# EAGLE board HDMI-LVDS (EAGLE 7.6.0)
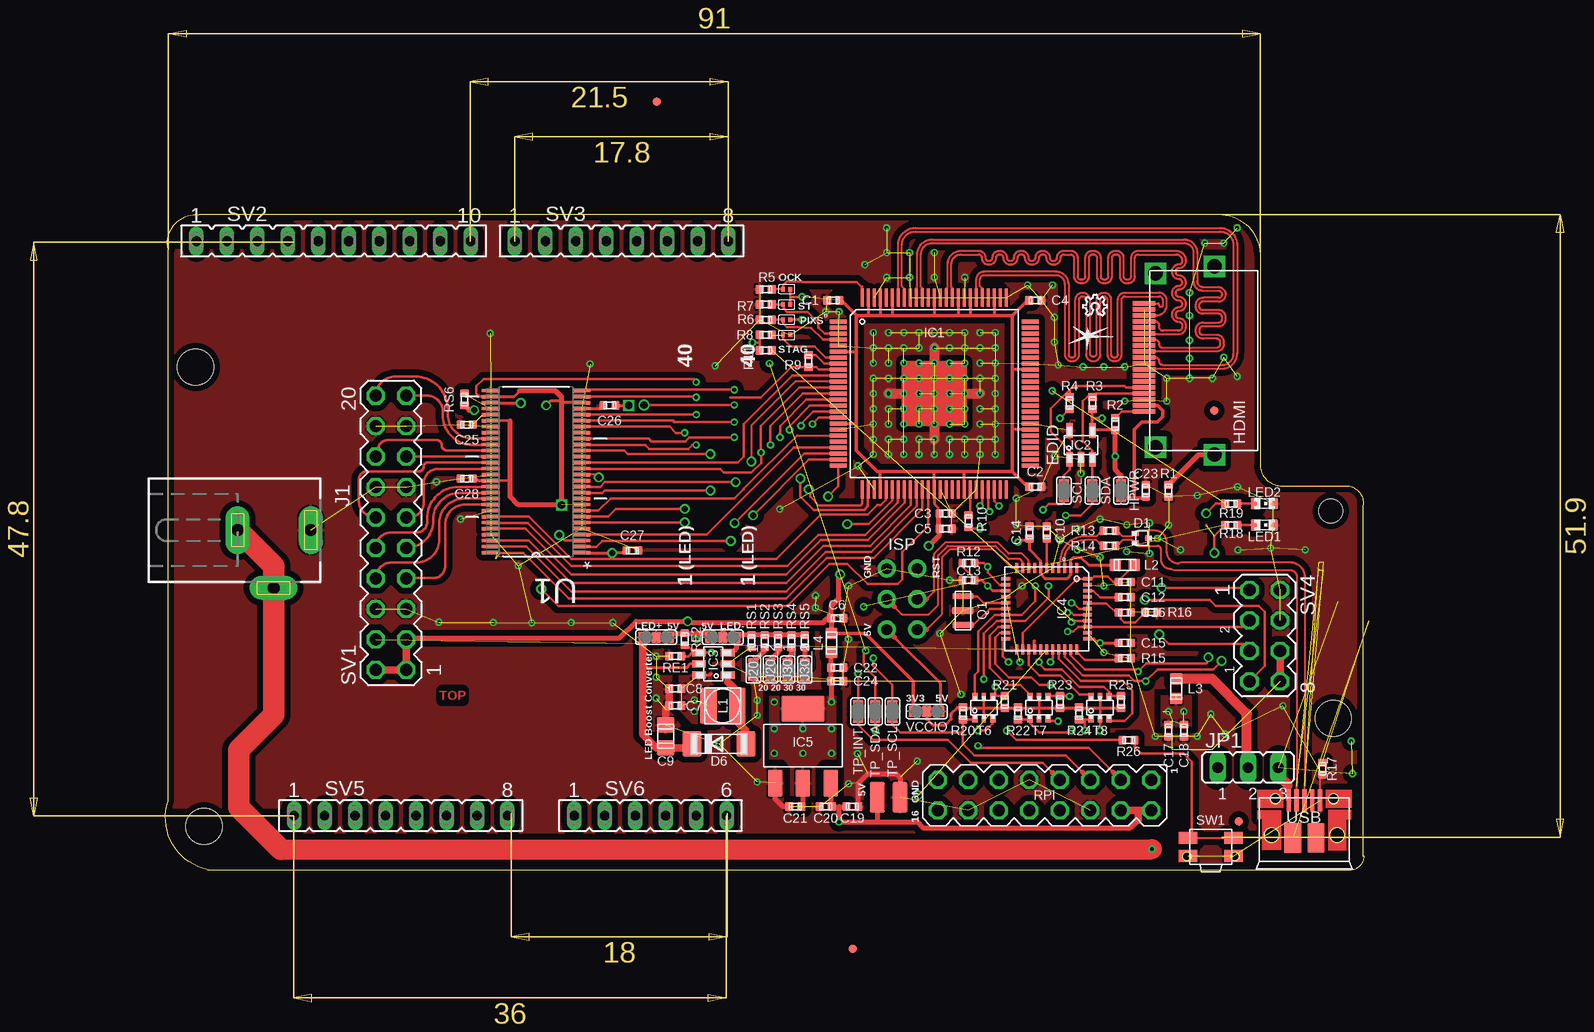
[diagram p3: board, top side]
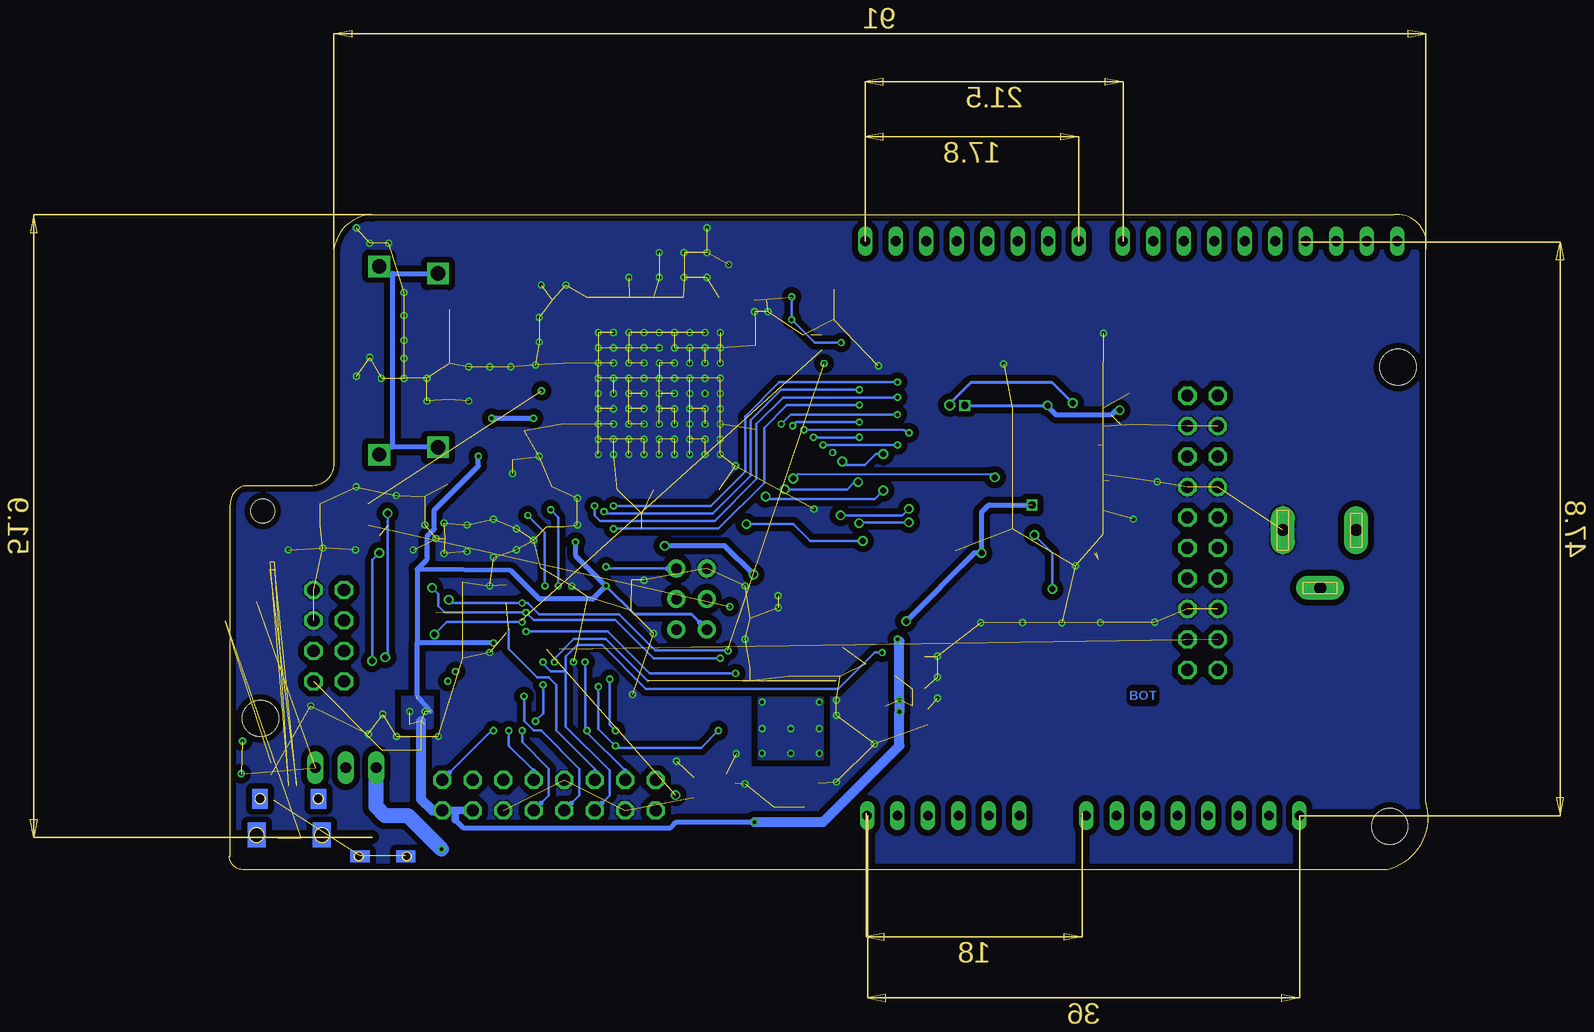
[diagram p4: board, bottom side, seen from below]

Size 99.91 x 54.62 mm. Coordinates in mm from the lower left corner, seen from the top.
Outline: 91.21,53.51 91.21,51.31
Outline: 91.21,51.31 91.21,33.71
Outline: 91.21,33.71 91.21,33.61
Outline: 91.21,33.71 arc90 93.11,32.01 98.41,32.01 arc-94 99.81,30.41 99.81,1.11 99.91,1.11 arc-93 98.61,0.01 3.51,0.01 arc-96 0.21,5.71 0.21,51.71 arc-108 2.81,54.61 88.01,54.61 arc-87 91.21,51.31
Copper layers (1*16): Top 0.035mm / dielectric 1.5mm / Bottom 0.035mm
Design rules "default *": minimum track width 6mil, minimum drill 0.3mm, track to track 6mil, track to pad 6mil, pad to pad 6mil, via to via 6mil, smd to smd 6mil, copper to edge 20mil, drill to drill 6mil, minimum pad ring 8mil, minimum via ring 6mil, stop-mask expansion 4mil, vias tented up to drill 0.5mm, thermal gap 6mil
Net classes: 0 default: clearance 0.5 mm
Holes 3 mm at 3.21,3.61 97.31,12.61 2.51,41.91
Holes 2 mm at 97.11,29.91

## Footprints (pad centres in the part's own frame; a part is rotated, then mirrored left to right if it is on the bottom)
PAD-1.27X2.54_NC = smd 1.27 x 2.54: 1 0,0
C0402 = smd 0.75 x 0.7: 1 0,0.5; 2 0,-0.5
C0805 = smd 1.5 x 1.25: 1 0,0.95; 2 0,-0.95
SOT723 = smd 0.6 x 0.4: 1 -0.55,0.4; 2 -0.55,-0.4; 3 0.55,0
SOD106 = smd 2.1 x 1.6: A 0,-2.25; C 0,2.25
HDMI_10029449 = smd 1.9 x 0.3: 1 -0.95,4.75; 2 -0.95,4.25; 3 -0.95,3.75; 4 -0.95,3.25; 5 -0.95,2.75; 6 -0.95,2.25; 7 -0.95,1.75; 8 -0.95,1.25; 9 -0.95,0.75; 10 -0.95,0.25; 11 -0.95,-0.25; 12 -0.95,-0.75; 13 -0.95,-1.25; 14 -0.95,-1.75; 15 -0.95,-2.25; 16 -0.95,-2.75; 17 -0.95,-3.25; 18 -0.95,-3.75; 19 -0.95,-4.25 | drill 1.2 pad 1.8 square: SHLD1 0,-7.25; SHLD2 4.9,-7.85; SHLD3 4.9,7.85; SHLD4 0,7.25
JUMPER2-0402 = smd 0.9 x 0.8: 1 0,0.55; 2 0,-0.55
TQFP100-PAD = smd 1.5 x 0.28: 1 -8,6; 2 -8,5.5; 3 -8,5; 4 -8,4.5; 5 -8,4; 6 -8,3.5; 7 -8,3; 8 -8,2.5; 9 -8,2; 10 -8,1.5; 11 -8,1; 12 -8,0.5; 13 -8,0; 14 -8,-0.5; 15 -8,-1; 16 -8,-1.5; 17 -8,-2; 18 -8,-2.5; 19 -8,-3; 20 -8,-3.5; 21 -8,-4; 22 -8,-4.5; 23 -8,-5; 24 -8,-5.5; 25 -8,-6; 51 8,-6; 52 8,-5.5; 53 8,-5; 54 8,-4.5; 55 8,-4; 56 8,-3.5; 57 8,-3; 58 8,-2.5; 59 8,-2; 60 8,-1.5; 61 8,-1; 62 8,-0.5; 63 8,0; 64 8,0.5; 65 8,1; 66 8,1.5; 67 8,2; 68 8,2.5; 69 8,3; 70 8,3.5; 71 8,4; 72 8,4.5; 73 8,5; 74 8,5.5; 75 8,6 | smd 0.28 x 1.5: 26 -6,-8; 27 -5.5,-8; 28 -5,-8; 29 -4.5,-8; 30 -4,-8; 31 -3.5,-8; 32 -3,-8; 33 -2.5,-8; 34 -2,-8; 35 -1.5,-8; 36 -1,-8; 37 -0.5,-8; 38 0,-8; 39 0.5,-8; 40 1,-8; 41 1.5,-8; 42 2,-8; 43 2.5,-8; 44 3,-8; 45 3.5,-8; 46 4,-8; 47 4.5,-8; 48 5,-8; 49 5.5,-8; 50 6,-8; 76 6,8; 77 5.5,8; 78 5,8; 79 4.5,8; 80 4,8; 81 3.5,8; 82 3,8; 83 2.5,8; 84 2,8; 85 1.5,8; 86 1,8; 87 0.5,8; 88 0,8; 89 -0.5,8; 90 -1,8; 91 -1.5,8; 92 -2,8; 93 -2.5,8; 94 -3,8; 95 -3.5,8; 96 -4,8; 97 -4.5,8; 98 -5,8; 99 -5.5,8; 100 -6,8
SOT23-5 = smd 1.2 x 0.6: 1 -1.2,0.95; 2 -1.2,0; 3 -1.2,-0.95; 4 1.2,-0.95; 5 1.2,0.95
SOT23-6 = smd 1.2 x 0.6: 1 -1.2,0.95; 2 -1.2,0; 3 -1.2,-0.95; 4 1.2,-0.95; 5 1.2,0; 6 1.2,0.95
QFN44 = smd 0.8 x 0.28: 1 -3.4,2.5; 2 -3.4,2; 3 -3.4,1.5; 4 -3.4,1; 5 -3.4,0.5; 6 -3.4,0; 7 -3.4,-0.5; 8 -3.4,-1; 9 -3.4,-1.5; 10 -3.4,-2; 11 -3.4,-2.5; 23 3.4,-2.5; 24 3.4,-2; 25 3.4,-1.5; 26 3.4,-1; 27 3.4,-0.5; 28 3.4,0; 29 3.4,0.5; 30 3.4,1; 31 3.4,1.5; 32 3.4,2; 33 3.4,2.5 | smd 0.28 x 0.8: 12 -2.5,-3.4; 13 -2,-3.4; 14 -1.5,-3.4; 15 -1,-3.4; 16 -0.5,-3.4; 17 0,-3.4; 18 0.5,-3.4; 19 1,-3.4; 20 1.5,-3.4; 21 2,-3.4; 22 2.5,-3.4; 34 2.5,3.4; 35 2,3.4; 36 1.5,3.4; 37 1,3.4; 38 0.5,3.4; 39 0,3.4; 40 -0.5,3.4; 41 -1,3.4; 42 -1.5,3.4; 43 -2,3.4; 44 -2.5,3.4
SOT223 = smd 2.235 x 1.219: 1 -3.099,2.311; 2 -3.099,0; 3 -3.099,-2.311 | smd 2.2 x 3.6: 4 3.099,0
ISP-2X3 = drill 0.9 pad 1.5: GND 1.27,-2.54; MISO -1.27,2.54; MOSI 1.27,0; RST -1.27,-2.54; SCK -1.27,0; VCC 1.27,2.54
DCJ0202 = drill 1 pad 2 long: 1 0,3.1; 2 4.8,0; 3 0,-3
JP2 = drill 0.914 long: 1 -2.54,0; 2 0,0; 3 2.54,0
L_1212 = smd 3 x 1.4: 1 0,1.2; 2 0,-1.2
C0603 = smd 1 x 0.95: 1 0,0.8; 2 0,-0.8
C0603' = smd 0.9 x 0.8: A 0,-0.75; C 0,0.75
JUMPER3-0402 = smd 0.9 x 0.8: 1 0,1.1; 2 0,0; 3 0,-1.1
JUMPER2-0201_NC = smd 0.4 x 0.4: 1 0,0.3; 2 0,-0.3
CRYSTAL_32X13 = smd 1.8 x 0.5: 1 0,1.2; 2 0,-1.2 | smd 1.8 x 0.6: GND 0,0
MA08-2 = drill 1 octagon: 1 -1.27,8.89; 2 1.27,8.89; 3 -1.27,6.35; 4 1.27,6.35; 5 -1.27,3.81; 6 1.27,3.81; 7 -1.27,1.27; 8 1.27,1.27; 9 -1.27,-1.27; 10 1.27,-1.27; 11 -1.27,-3.81; 12 1.27,-3.81; 13 -1.27,-6.35; 14 1.27,-6.35; 15 -1.27,-8.89; 16 1.27,-8.89
MA10-2 = drill 1.016 octagon: 1 -11.43,-1.27; 2 -11.43,1.27; 3 -8.89,-1.27; 4 -8.89,1.27; 5 -6.35,-1.27; 6 -6.35,1.27; 7 -3.81,-1.27; 8 -3.81,1.27; 9 -1.27,-1.27; 10 -1.27,1.27; 11 1.27,-1.27; 12 1.27,1.27; 13 3.81,-1.27; 14 3.81,1.27; 15 6.35,-1.27; 16 6.35,1.27; 17 8.89,-1.27; 18 8.89,1.27; 19 11.43,-1.27; 20 11.43,1.27
FE10 = drill 0.813 long: 1 -11.43,0; 2 -8.89,0; 3 -6.35,0; 4 -3.81,0; 5 -1.27,0; 6 1.27,0; 7 3.81,0; 8 6.35,0; 9 8.89,0; 10 11.43,0
FE08 = drill 0.813 long: 1 -8.89,0; 2 -6.35,0; 3 -3.81,0; 4 -1.27,0; 5 1.27,0; 6 3.81,0; 7 6.35,0; 8 8.89,0
MA04-2 = drill 1.016 octagon: 1 -3.81,-1.27; 2 -3.81,1.27; 3 -1.27,-1.27; 4 -1.27,1.27; 5 1.27,-1.27; 6 1.27,1.27; 7 3.81,-1.27; 8 3.81,1.27
FE06 = drill 0.813 long: 1 -6.35,0; 2 -3.81,0; 3 -1.27,0; 4 1.27,0; 5 3.81,0; 6 6.35,0
PTS840P = smd 1.65 x 1: 1 -1.9,0.75; 2 1.9,0.75; 3 -1.9,-0.75; 4 1.9,-0.75 | hole 0.7: -2,-0.8; 2,-0.8
SOT363 = smd 0.6 x 0.5: 1 -0.9,0.75; 3 -0.9,-0.75; 4 0.9,-0.75; 6 0.9,0.75 | smd 0.6 x 0.4: 2 -0.9,0; 5 0.9,0
SOP50P810X120-56N = smd 1.473 x 0.279: 1 -3.785,6.756; 2 -3.785,6.248; 3 -3.785,5.74; 4 -3.785,5.258; 5 -3.785,4.75; 6 -3.785,4.242; 7 -3.785,3.759; 8 -3.785,3.251; 9 -3.785,2.743; 10 -3.785,2.261; 11 -3.785,1.753; 12 -3.785,1.245; 13 -3.785,0.762; 14 -3.785,0.254; 15 -3.785,-0.254; 16 -3.785,-0.762; 17 -3.785,-1.245; 18 -3.785,-1.753; 19 -3.785,-2.261; 20 -3.785,-2.743; 21 -3.785,-3.251; 22 -3.785,-3.759; 23 -3.785,-4.242; 24 -3.785,-4.75; 25 -3.785,-5.258; 26 -3.785,-5.74; 27 -3.785,-6.248; 28 -3.785,-6.756; 29 3.785,-6.756; 30 3.785,-6.248; 31 3.785,-5.74; 32 3.785,-5.258; 33 3.785,-4.75; 34 3.785,-4.242; 35 3.785,-3.759; 36 3.785,-3.251; 37 3.785,-2.743; 38 3.785,-2.261; 39 3.785,-1.753; 40 3.785,-1.245; 41 3.785,-0.762; 42 3.785,-0.254; 43 3.785,0.254; 44 3.785,0.762; 45 3.785,1.245; 46 3.785,1.753; 47 3.785,2.261; 48 3.785,2.743; 49 3.785,3.251; 50 3.785,3.759; 51 3.785,4.242; 52 3.785,4.75; 53 3.785,5.258; 54 3.785,5.74; 55 3.785,6.248; 56 3.785,6.756
USB-MICROB-10103594 = smd 1.8 x 0.4: D+ -2.885,0; D- -2.885,-0.65; GND -2.885,1.3; ID -2.885,0.65; VBUS -2.885,-1.3 | smd 2.5 x 1.425: SHLD1 0.25,-0.963; SHLD2 0.25,0.963 | hole 0.8: -3,2.425; -3,-2.425 | hole 1.2: 0.03,2.725; 0.03,-2.725
PASSER_07MM = smd 0.7 x 0.7: X 0,0

## Placement (x,y rotation side)
5V  PAD-1.27X2.54_NC  [PAD-1.27X2.54_NC]  59.31,6.04 0 top
C1  100n  [C0402]  55.66,47.47 90 top
C2  100n  [C0402]  72.49,31.92 270 top
C3  100n  [C0402]  65.02,29.69 270 top
C4  100n  [C0402]  72.49,47.47 270 top
C5  4u7  [C0402]  65.02,28.42 270 top
C6  4u7  [C0402]  55.98,20.96 90 top
C7  2u  [C0402]  42.48,13.66 90 top
C8  100n  [C0402]  42.48,15.09 90 top
C9  1u @ 40V  [C0805]  41.69,11.12 0 top
C10  1u  [C0402]  73.44,28.11 0 top
C11  100n  [C0402]  79.95,23.98 90 top
C12  100n  [C0402]  79.95,22.71 270 top
C13  100n  [C0402]  66.93,24.14 90 top
C14  100n  [C0402]  72.01,28.11 0 top
C15  100n  [C0402]  79.95,18.9 270 top
C16  tbd  [C0402]  79.95,21.44 270 top
C17  100n  [C0402]  83.6,11.6 180 top
C18  4u7  [C0402]  84.87,11.6 180 top
C19  4u7  [C0402]  57.25,5.25 270 top
C20  100n  [C0402]  55.02,5.25 90 top
C21  100n  [C0402]  52.48,5.25 90 top
C22  4u7  [C0402]  55.98,16.84 270 top
C23  100n  [C0402]  81.69,31.6 0 top
C24  4u7  [C0402]  55.98,15.72 270 top
C25  10n  [C0402]  25.11,37.11 90 top
C26  10n  [C0402]  37.01,38.71 90 top
C27  10n  [C0402]  38.91,26.61 270 top
C28  10n  [C0402]  25.11,32.61 90 top
D1  D_ESD5V3U2U-03F  [SOT723]  81.38,27.63 0 top
D6  DIODE-SOD106  [SOD106]  46.13,10.49 90 top
GND  PAD-1.27X2.54_NC  [PAD-1.27X2.54_NC]  61.21,6.04 0 top
HDMI  HDMI-A  [HDMI_10029449]  82.51,42.46 0 top
HPWR  JUMPER2-0402  [JUMPER2-0402]  79.63,31.6 180 top
IC1  TFP401A-PAD  [TQFP100-PAD]  64.07,39.7 0 top
IC2  24LC02B  [SOT23-5]  76.3,35.41 90 top
IC3  IS31BL3506A-TTLS2  [SOT23-6]  45.66,17.15 180 top
IC4  ATMEGA32U4-MU  [QFN44]  73.44,21.76 270 top
IC5  LDO-TS1117CW-3V3  [SOT223]  53.12,10.33 90 top
ISP  ISP  [ISP-2X3]  61.37,22.55 180 top
J1  DCJ0202  [DCJ0202]  9.01,28.31 270 top
J20_1  JUMPER2-0402  [JUMPER2-0402]  48.99,16.68 0 top
J20_2  JUMPER2-0402  [JUMPER2-0402]  50.42,16.68 0 top
J30_1  JUMPER2-0402  [JUMPER2-0402]  51.85,16.68 0 top
J30_2  JUMPER2-0402  [JUMPER2-0402]  53.28,16.68 0 top
JP1  [JP2]  90.21,8.51 0 top
L1  10u@500mA  [L_1212]  46.45,13.66 90 top
L2  [C0603]  79.95,25.41 90 top
L3  BLM18PG221SH1D  [C0603]  84.23,15.09 180 top
L4  BLM18PG221SH1D  [C0603]  55.5,18.9 0 top
LED1  green  [C0603']  91.58,28.73 270 top
LED2  red  [C0603']  91.58,30.52 270 top
LED+  JUMPER3-0402  [JUMPER3-0402]  40.89,19.38 90 top
LED-  JUMPER3-0402  [JUMPER3-0402]  46.45,19.38 270 top
LOGO1  OSHW_LOGOX0070  [OSHW_6X70]  76.48,46.19 0 top
LOGO3  LOGO-S_PLACE_S  [SPARK_TPLACE_S]  76.87,44.48 0 top
OCK  JUMPER2-0201-NC  [JUMPER2-0201_NC]  51.77,48.39 90 top
PIXS  JUMPER2-0201-NC  [JUMPER2-0201_NC]  51.77,45.85 90 top
Q1  16MHz  [CRYSTAL_32X13]  66.45,21.6 0 top
R1  0  [C0402]  83.6,31.6 180 top
R2  1k  [C0402]  79.15,37.16 0 top
R3  10k  [C0402]  77.25,38.9 180 top
R4  10k  [C0402]  75.34,38.9 180 top
R5  10k  [C0402]  50.02,48.39 90 top
R6  10k  [C0402]  50.02,45.85 90 top
R7  10k  [C0402]  50.02,47.12 90 top
R8  10k  [C0402]  50.02,44.58 270 top
R9  1k  [C0402]  53.59,42.39 180 top
R10  22  [C0402]  66.93,29.06 0 top
R11  nc  [C0402]  50.02,43.31 270 top
R12  10k  [C0402]  66.93,25.57 270 top
R13  22  [C0402]  78.68,28.27 270 top
R14  22  [C0402]  78.68,27 270 top
R15  10k  [C0402]  79.95,17.63 90 top
R16  tbd  [C0402]  82.15,21.47 270 top
R17  0  [C0402]  96.42,8.41 180 top
R18  4k7  [C0402]  88.82,28.73 90 top
R19  4k7  [C0402]  88.82,30.52 90 top
R20  4k7  [C0402]  66.45,13.03 180 top
R21  4k7  [C0402]  69.95,13.98 0 top
R22  4k7  [C0402]  71.06,13.03 180 top
R23  4k7  [C0402]  74.55,13.98 0 top
R24  4k7  [C0402]  76.14,13.03 180 top
R25  4k7  [C0402]  79.63,13.98 0 top
R26  1k  [C0402]  80.26,10.8 90 top
RE1  100k  [C0402]  42.48,17.79 90 top
RE2  NM  [C0402]  43.28,19.22 180 top
RPI  MA08-2  [MA08-2]  73.26,6.21 270 top
RS1  15  [C0402]  48.83,19.06 180 top
RS2  15  [C0402]  49.94,19.06 180 top
RS3  15  [C0402]  51.05,19.06 180 top
RS4  10  [C0402]  52.17,19.06 180 top
RS5  10  [C0402]  53.28,19.06 180 top
RS6  10  [C0402]  24.91,39.21 0 top
SCL  JUMPER2-0402  [JUMPER2-0402]  74.87,31.6 0 top
SDA  JUMPER2-0402  [JUMPER2-0402]  77.25,31.6 0 top
ST  JUMPER2-0201-NC  [JUMPER2-0201_NC]  51.77,47.12 90 top
STAG  JUMPER2-0201-NC  [JUMPER2-0201_NC]  51.77,44.58 270 top
SV1  [MA10-2]  18.8,28.09 90 top
SV2  [FE10]  14.01,52.41 0 top
SV3  [FE08]  38.01,52.41 0 top
SV4  [MA04-2]  91.61,19.51 270 top
SV5  [FE08]  19.61,4.51 0 top
SV6  [FE06]  40.41,4.51 0 top
SW1  SW-TACTILE-PTS840P  [PTS840P]  87.11,1.91 0 top
T6  BSS138PS  [SOT363]  68.2,13.5 90 top
T7  BSS138PS  [SOT363]  72.8,13.5 90 top
T8  BSS138PS  [SOT363]  77.88,13.5 90 top
TP_INT  JUMPER2-0402  [JUMPER2-0402]  57.72,13.18 0 top
TP_SCL  JUMPER2-0402  [JUMPER2-0402]  60.58,13.18 0 top
TP_SDA  JUMPER2-0402  [JUMPER2-0402]  59.15,13.18 0 top
U1  SN75LVDS83BDGG  [SOP50P810X120-56N]  30.89,33.19 180 top
USB  USB-MICROB  [USB-MICROB-10103594]  94.91,2.91 270 top
VCCIO  JUMPER3-0402  [JUMPER3-0402]  63.44,13.18 270 top
X1  PASSER-07  [PASSER_07MM]  57.29,-6.59 90 top  (outside the outline)
X2  PASSER-07  [PASSER_07MM]  40.93,64.03 90 top  (outside the outline)
X3  PASSER-07  [PASSER_07MM]  87.41,38.27 90 top
X4  PASSER-07  [PASSER_07MM]  89.45,4.01 90 top

## Tracks (layer width: path | path; a pad name or v marks a point on that pad's centre or on a via)
3VOUT  (via drill 0.3)
  Top 0.406: IC5.2 53.12,5.38 C21.2 | L4.2 55.47,18.08 C22.2 C24.2 55.47,14.27
  other vias: 50.74,13.98 50.74,9.69 55.5,9.69 55.5,13.98 55.5,11.76 50.74,11.76 53.12,9.69 53.12,11.76
  pour Bottom: 50.42,14.45 55.82,14.45 55.82,9.22 50.42,9.22
  pour Top: 50.42,14.45 55.82,14.45 55.82,9.22 54.71,9.22 54.07,8.58 54.07,6.2 52.17,6.2 52.17,8.58 51.53,9.22 50.42,9.22
+3V3  (via drill 0.3, 0.5 pad 0.25, 0.5 pad 0.61, 0.6)  (4 unrouted)
  Top 0.2: U1.1 34.7,26.41 | U1.34 28.69,37.43 28.71,37.41 | U1.44 28.69,32.43 28.71,32.41
  Top 0.203: 58.57,46.26 58.52,46.21 | 60.57,46.21 60.58,46.21 | 69.07,46.28 68.99,46.21 | 67.07,46.22 67.09,46.21 | 66.07,46.27 66.13,46.21 | 70.64,41.7 70.58,41.76 | 70.6,36.7 70.58,36.68 | 66.57,33.15 66.61,33.19 | 59.57,33.13 59.63,33.19 | 57.56,43.2 57.56,43.19 | 57.55,42.7 57.56,42.71 | 57.52,37.2 57.56,37.16 | 59.57,46.26 59.63,46.21 | 64.39,30.17 64.39,29.7 C3.2 | ST.2 52.07,47.76 | 52.07,47.76 OCK.2 | R11.2 49.52,43.95 | 49.52,43.95 R8.2 | PIXS.2 v53.04,45.85 | v53.04,47.76 52.07,47.76 | v48.91,43.95 49.52,43.95 | C5.2 64.4,28.43 64.39,28.44
  Top 0.254: IC1.99 58.57,46.26 | IC1.95 60.57,46.21 | IC1.78 69.07,46.28 | IC1.82 67.07,46.22 | IC1.84 66.07,46.27 | IC1.88 64.07,46.21 | IC1.67 70.64,41.7 | IC1.57 70.6,36.7 | IC1.43 66.57,33.15 | 64.07,33.19 IC1.38 64.07,30.49 64.39,30.17 | IC1.29 59.57,33.13 | IC1.6 57.56,43.2 | IC1.18 57.52,37.2 | IC1.97 59.57,46.26 | 70.58,46.21 70.58,46.22 | 57.56,46.21 57.56,46.22 | 70.58,33.19 70.58,33.17 | U1.26 33.19,38.93 33.01,39.11 32.11,39.11 v31.71,38.71 | 29.51,39.91 29.01,39.41 27.14,39.41 | 25.51,32.41 C28.2 25.91,32.61 26.11,32.41 26.61,32.41 | C27.2 38.21,26.41 v37.21,26.41 34.7,26.41 | C26.2 v38.61,38.71
  Top 0.305: 70.58,46.21 68.99,46.21 67.09,46.21 66.13,46.21 64.07,46.21 60.58,46.21 59.63,46.21 58.52,46.21 57.56,46.21 57.56,43.19 57.56,42.71 57.56,37.16 57.56,34.93 59.31,33.19 59.63,33.19 64.07,33.19 66.61,33.19 70.58,33.19 | 70.58,46.21 70.58,41.76 70.58,36.68 70.58,33.19 | C2.2 71.85,31.92 70.58,33.19 | C4.2 71.85,47.47 70.58,46.21 | C1.2 56.31,47.47 57.56,46.22 | VCCIO.3 62.34,15.68 58.31,19.71 L4.1
  Top 0.406: 64.39,29.7 64.39,28.44 | C6.1 55.47,19.72 L4.1 | C6.1 55.47,21.97 56.11,22.61 56.11,24.51 v56.21,24.61 | v63.61,27.01 64.52,27.92 C5.2 | 55.33,21.11 C6.1 | 37.19,26.43 v37.21,26.41 | 29.51,39.91 32.51,39.91 33.01,39.41 33.01,39.11 v33.01,30.41 29.41,30.41 28.71,31.11 28.71,32.41 28.71,37.41 | C6.1 55.17,20.96 54.81,20.61 43.61,20.61 v43.51,20.71 39.21,20.71 37.81,19.31 20.18,19.31 SV1.3 | v25.71,38.31 25.31,38.31 RS6.2
  Top 0.61: SV1.2 SV1.1 SV1.3
  Bottom 0.203: v53.04,47.76 v53.04,45.85 51.14,43.95 v48.91,43.95
  Bottom 0.254: v38.61,38.71 v31.71,38.71
  Bottom 0.406: v56.21,24.61 58.61,27.01 v63.61,27.01 | v43.51,20.71 37.81,26.41 v37.21,26.41 37.21,29.81 36.61,30.41 v33.01,30.41 | v31.71,38.71 31.71,38.61 31.01,37.91 26.41,37.91 26.01,38.31 v25.71,38.31
+5V  (via drill 0.3)  (13 unrouted)
  Top 0.203: LED-.3 45.35,19.52 45.34,19.54 | 64.55,13.2 VCCIO.1 | R4.1 75.32,38.4 v74.55,37.63 | 77.25,38.25 R3.1 | C13.2 67.43,24.27 66.45,25.25 66.45,25.54 R12.2
  Top 0.254: 45.5,16.36 45.34,16.2 IC3.6 | IC4.34 77.37,19.26 77.72,18.9 v77.88,18.9 C15.2 | L2.1 76.93,25.41 76.29,26.04 75.66,26.04 75.44,25.82 IC4.2 75.44,24.55 75.18,24.3 73.28,24.3 72.94,24.64 IC4.7 72.94,25.75 72.01,26.68 C14.2 | 72.01,27.31 C14.2 | IC4.14 68.92,23.26 v68.52,23.66 68.04,24.14 C13.2 | v71.06,27.31 71.22,27.47 72.01,27.47 C14.2 | 77.25,37.63 IC2.4 77.29,36.66 R2.2 | 77.25,37.63 77.25,38.25 | v78.04,37.63 77.25,37.63 | 60.74,19.38 64.55,15.57 64.55,13.2
  Top 0.406: 59.31,3.98 v56.13,3.98 56.13,5.25 | 59.31,3.98 62.64,3.98 63.12,3.5 80.42,3.5 81.05,4.13 | HPWR.2 79.63,32.87 79.15,33.35 v79.15,34.46 R2.2 | LED+.3 42.01,19.38 42.01,19.69 43.28,19.69 RE2.2 43.3,19.69 44.23,19.69 | 45.34,19.54 45.34,19.69 44.23,19.69 | 44.23,19.69 v44.23,19.22 | ISP.VCC 60.74,19.38 | IC5.3 55.43,5.34 C20.2 56.13,5.25 | 56.13,5.25 C19.2 | 5V.1 59.31,3.98
  Top 0.61: RPI.2 81.06,4.94 | 81.06,4.94 RPI.4 | 81.06,4.94 81.05,4.93 81.05,4.13 | SV4.6 SV4.8
  Bottom 0.254: 60.74,20.65 61.37,21.28 66.13,21.28 v68.52,23.66
  Bottom 0.406: 84.25,25.03 76.45,24.93 74.07,22.55 69.63,22.55 v68.52,23.66 71.06,26.2 v71.06,27.31 | 84.25,25.03 84.25,18.9 | v77.88,18.9 84.25,18.9 | 83.12,13.18 84.23,14.48 84.25,16.36 84.25,18.9 | v74.55,37.63 v78.04,37.63 | v56.13,3.98 62.64,3.98 63.12,3.5 80.42,3.5 81.06,4.14 | RPI.4 79.63,4.93 | ISP.VCC 60.74,20.65 | 84.25,25.03 83.41,25.87 83.41,27.81 82.81,28.41 82.81,30.01 79.15,33.67 v79.15,34.46
  Bottom 0.61: 79.63,4.93 81.06,4.93 | 81.06,4.93 82.17,4.93 | 81.06,4.14 81.06,4.93 | 44.07,19.06 v44.23,19.22
  Bottom 0.813: 83.92,12.39 83.92,5.88 82.97,4.94 RPI.2 | 44.07,19.06 v44.07,14.14 v44.07,13.18 44.07,10.33 50.42,3.98 v56.13,3.98
  other vias: 84.87,13.18 83.6,13.18
  pour Top: 42.8,16.52 42.8,13.34 43.91,12.23 45.97,12.23 45.97,15.09 45.5,15.57 45.5,16.52
  pour Top: 82.96,14.45 82.96,11.76 85.5,11.76 85.5,14.45
  pour Bottom: 82.96,11.76 85.5,11.76 85.5,14.45 82.96,14.45
AREF
  Top 0.203: IC4.42 77.33,23.26 77.88,22.71 C12.2
AVCC
  Top 0.203: IC4.24 71.44,19.76 75.94,24.26 IC4.44 77.21,24.26 77.41,24.46 78.52,24.46 78.99,23.98 C11.1 79.47,24 79.47,24.14 L2.2
B0
  Top 0.152: 34.68,33.96 U1.16
  Top 0.2: 48.2,34.46 47.69,33.95 U1.16
  Top 0.203: IC1.10 52.24,41.2 48.2,37.16 48.2,34.46
B1  (via drill 0.5 pad 0.25)
  Top 0.152: IC1.11 56.06,40.68 52.48,40.68 48.83,37.04 48.84,34.48 48.83,34.48 v48.83,34.03 | U1.18
  Top 0.2: v45.41,34.65 38.53,34.65 38.24,34.94 U1.18
  Bottom 0.2: v48.83,34.03 48.53,33.73 46.96,33.73 46.04,34.65 v45.41,34.65
B2  (via drill 0.3)
  Top 0.152: 34.72,33.4 U1.15 | 49.64,34.76 v49.63,34.78
  Top 0.2: 34.72,33.4 46.23,33.4 46.52,33.11 48.83,33.11 49.64,33.91 49.64,34.76
  Top 0.203: IC1.12 52.82,40.2 49.63,37 v49.63,34.78
  Bottom 0.203: 49.47,34.93 v49.63,34.78
B3  (via drill 0.3)
  Top 0.152: 44.19,35.45 v44.23,35.41 | U1.19 34.73,35.39
  Top 0.2: 34.73,35.39 39.99,35.39 40.31,35.07 43.57,35.07 43.91,35.41 v44.23,35.41
  Top 0.203: IC1.13 53.12,39.7 50.42,37 v50.42,35.41 | v44.23,35.41
  Bottom 0.203: v50.42,35.41 v44.23,35.41
B4  (via drill 0.3)
  Top 0.152: U1.20 34.75,35.86 34.82,35.93
  Top 0.2: 34.82,35.93 40.26,35.93 40.5,35.69 43.31,35.69 43.66,36.04 v47.4,36.04
  Top 0.203: IC1.14 53.41,39.2 51.21,37 v51.21,36.04
  Bottom 0.203: v51.21,36.04 v47.4,36.04
B5  (via drill 0.3)
  Top 0.152: v43.27,36.42 43.25,36.44 | U1.22
  Top 0.2: U1.22 42.01,36.95 42.54,36.42 v43.27,36.42
  Top 0.203: IC1.15 53.71,38.7 52.01,37 v52.01,36.68
  Bottom 0.203: v43.27,36.42 43.71,36.66 v52.01,36.68
B6  (via drill 0.3)
  Top 0.152: U1.23 | v47.4,37.32 v47.39,37.32
  Top 0.2: v47.39,37.32 42.4,37.32 42.3,37.43 U1.23
  Top 0.203: IC1.16 54,38.2 52.96,37.16 v52.96,37
  Top 0.254: U1.23
  Bottom 0.203: v52.96,37 52.64,37.32 v47.4,37.32
B7  (via drill 0.3)
  Top 0.152: v44.23,37.94 | U1.24
  Top 0.2: U1.24 v44.23,37.94
  Top 0.203: IC1.17 54.45,37.7 v53.91,37.16
  Bottom 0.203: v44.23,37.94 46.34,37.94 46.93,37.95 53.12,37.95 v53.91,37.16
CLK  (via drill 0.3, 0.5 pad 0.25, 0.6 pad 0.25)
  Top 0.152: U1.31 27.12,38.94 | 47.39,38.73 v47.4,38.74
  Top 0.2: v39.88,38.73 47.39,38.73
  Top 0.203: v67.88,28.43 66.93,28.43 R10.2
  Top 0.254: 27.12,38.94 27.15,38.91 v29.61,38.91
  Bottom 0.152: 39.67,38.94 v39.88,38.73
  Bottom 0.203: v47.4,38.74 53.43,38.74 55.34,36.84 55.34,32.23 59.15,28.43 v67.88,28.43
  Bottom 0.254: v29.61,38.91 31.31,40.61 38.11,40.61 39.88,38.84 v39.88,38.73
CLK+
  Top 0.152: 17.71,35.01 17.71,34.62 arc-90 SV1.16
  Top 0.2: U1.39 23.48,34.94 arc-90 23.01,35.41 arc90 22.61,35.81 18.51,35.81 arc90 17.71,35.01
CLK-
  Top 0.152: 27.08,34.41 arc90 27.05,34.44
  Top 0.2: 27.08,34.41 U1.40 | 20.1,34.41 SV1.15 27.05,34.44
CLK_N
  Top 0.152: IC1.94 61.07,48.42 61.06,48.43 61.06,52.08 arc-90 62.48,53.5 87.88,53.5 arc-90 89.31,52.08 89.31,43.03 arc-90 88.04,41.77 81.62,41.77 HDMI.12
CLK_P
  Top 0.152: IC1.93 61.57,48.44 61.37,48.65 61.37,52.08 arc-90 62.48,53.2 87.88,53.2 arc-90 89,52.08 89,43.03 arc-90 88.04,42.07 83.13,42.07 arc-90 82.8,42.4 arc90 82.49,42.71 HDMI.10
D0_N
  Top 0.152: IC1.91 62.57,48.51 62.65,48.59 62.65,51.29 arc-90 63.91,52.55 84.87,52.55 arc-90 85.97,51.44 85.97,49.06 arc90 86.46,48.58 87.72,48.58 arc-90 88.35,47.95 arc-90 87.78,47.38 86.44,47.38 arc90 86.17,47.11 86.17,46.92 arc90 86.44,46.65 87.78,46.65 arc-90 88.35,46.08 88.35,45.88 arc-90 87.78,45.31 86.45,45.31 arc90 86.18,45.04 86.18,44.85 arc90 86.45,44.58 87.62,44.58 arc-90 88.19,44.01 88.19,43.82 arc-90 87.57,43.2 82.32,43.2 82.31,43.21 HDMI.9
D0_P
  Top 0.152: IC1.90 63.07,48.47 62.95,48.59 62.95,51.29 arc-90 63.91,52.24 84.87,52.24 arc-90 85.67,51.44 85.67,49.06 arc90 86.46,48.28 87.72,48.28 arc-90 88.05,47.95 arc-90 87.78,47.68 86.45,47.68 arc90 85.87,47.11 85.87,46.92 arc90 86.45,46.35 87.78,46.35 arc-90 88.05,46.08 88.05,45.88 arc-90 87.78,45.62 86.45,45.62 arc90 85.87,45.04 85.87,44.85 arc90 86.45,44.28 87.62,44.28 arc-90 87.89,44.01 87.89,43.82 arc-90 87.57,43.5 83.13,43.5 arc-90 82.8,43.82 arc90 82.42,44.21 HDMI.7
D1_N
  Top 0.152: IC1.86 65.07,48.47 65.19,48.59 65.19,50.49 arc-90 66.29,51.6 67.76,51.6 arc-90 68.33,51.02 arc90 68.6,50.76 68.65,50.76 arc90 68.92,51.02 arc-90 69.49,51.6 69.55,51.6 arc-90 70.12,51.02 arc90 70.39,50.76 70.45,50.76 arc90 70.71,51.02 arc-90 71.28,51.6 71.34,51.6 arc-90 71.91,51.02 arc90 72.18,50.76 72.24,50.76 arc90 72.5,51.02 arc-90 73.07,51.6 73.13,51.6 arc-90 73.7,51.02 arc90 73.97,50.76 74.03,50.76 arc90 74.29,51.02 arc-90 74.87,51.6 75.44,51.6 arc-90 76.01,51.02 76.01,49.48 arc90 76.28,49.21 76.4,49.21 arc90 76.66,49.48 76.66,51.02 arc-90 77.24,51.6 77.35,51.6 arc-90 77.92,51.02 77.92,49.48 arc90 78.19,49.21 78.31,49.21 arc90 78.58,49.48 78.58,51.02 arc-90 79.15,51.6 79.26,51.6 arc-90 79.84,51.02 79.84,49.48 arc90 80.1,49.21 80.22,49.21 arc90 80.49,49.48 80.49,51.02 arc-90 81.06,51.6 84.23,51.6 arc-90 85.02,50.81 85.02,50.72 arc-90 84.45,50.15 arc90 84.18,49.88 84.18,49.83 arc90 84.45,49.56 arc-90 85.02,48.99 85.02,48.93 arc-90 84.45,48.36 arc90 84.18,48.09 84.18,48.04 arc90 84.45,47.77 arc-90 85.02,47.2 85.02,47.14 arc-90 84.45,46.57 arc90 84.18,46.31 84.18,46.25 arc90 84.45,45.98 arc-90 85.02,45.41 85.02,45.25 arc-90 84.39,44.62 81.65,44.62 HDMI.6
D1_P
  Top 0.152: IC1.85 65.57,48.51 65.49,48.59 65.49,50.49 arc-90 66.29,51.29 67.76,51.29 arc-90 68.02,51.02 arc90 68.6,50.45 68.65,50.45 arc90 69.23,51.02 arc-90 69.49,51.29 69.55,51.29 arc-90 69.82,51.02 arc90 70.39,50.45 70.45,50.45 arc90 71.02,51.02 arc-90 71.28,51.29 71.34,51.29 arc-90 71.61,51.02 arc90 72.18,50.45 72.24,50.45 arc90 72.81,51.02 arc-90 73.07,51.29 73.13,51.29 arc-90 73.4,51.02 arc90 73.97,50.45 74.03,50.45 arc90 74.6,51.02 arc-90 74.87,51.29 75.44,51.29 arc-90 75.71,51.02 75.71,49.48 arc90 76.28,48.9 76.4,48.9 arc90 76.97,49.48 76.97,51.02 arc-90 77.24,51.29 77.35,51.29 arc-90 77.62,51.02 77.62,49.48 arc90 78.19,48.9 78.31,48.9 arc90 78.88,49.48 78.88,51.02 arc-90 79.15,51.29 79.26,51.29 arc-90 79.53,51.02 79.53,49.48 arc90 80.1,48.9 80.22,48.9 arc90 80.79,49.48 80.79,51.02 arc-90 81.06,51.29 84.23,51.29 arc-90 84.72,50.81 84.72,50.72 arc-90 84.45,50.45 arc90 83.88,49.88 83.88,49.83 arc90 84.45,49.26 arc-90 84.72,48.99 84.72,48.93 arc-90 84.45,48.67 arc90 83.88,48.09 83.88,48.04 arc90 84.45,47.47 arc-90 84.72,47.2 84.72,47.14 arc-90 84.45,46.88 arc90 83.88,46.31 83.88,46.25 arc90 84.45,45.68 arc-90 84.72,45.41 84.72,45.25 arc-90 84.39,44.93 83.13,44.93 arc-90 82.8,45.25 82.8,45.41 arc90 82.51,45.71 HDMI.4
D2_N
  Top 0.152: 67.57,48.59 | 67.57,48.59 67.57,49.22 arc-90 68.2,49.85 74.23,49.85 arc-90 75.26,48.83 75.26,42.97 arc90 75.52,42.7 75.57,42.7 arc90 75.84,42.97 75.84,47.53 arc-90 76.41,48.1 76.45,48.1 arc-90 77.03,47.53 77.03,43.06 arc90 77.29,42.79 77.34,42.79 arc90 77.61,43.06 77.61,47.53 arc-90 78.18,48.1 78.22,48.1 arc-90 78.79,47.53 78.79,42.97 arc90 79.06,42.7 79.11,42.7 arc90 79.37,42.97 79.37,47.53 arc-90 79.95,48.1 82.8,48.1 arc-90 83.43,47.47 83.43,47.32 arc-90 83.44,47.31 83.44,47.09 arc-90 82.56,46.21 HDMI.3 | IC1.81 67.57,48.59
D2_P
  Top 0.152: IC1.80 68.07,48.45 67.87,48.65 67.87,49.22 arc-90 68.2,49.55 74.23,49.55 arc-90 74.95,48.83 74.95,42.97 arc90 75.52,42.4 75.57,42.4 arc90 76.14,42.97 76.14,47.53 arc-90 76.41,47.8 76.45,47.8 arc-90 76.72,47.53 76.72,42.97 arc90 77.29,42.4 77.34,42.4 arc90 77.91,42.97 77.91,47.53 arc-90 78.18,47.8 78.22,47.8 arc-90 78.49,47.53 78.49,42.97 arc90 79.06,42.4 79.11,42.4 arc90 79.68,42.97 79.68,47.53 arc-90 79.95,47.8 82.8,47.8 arc-90 83.13,47.47 83.13,47.1 arc-90 82.96,46.93 arc-90 82.8,47.09 arc90 82.69,47.21 HDMI.1
D_N
  Top 0.152: R14.2 78.04,27 77.57,27.47 76.61,27.47 arc90 74.86,25.73 74.94,25.65 IC4.3
D_P
  Top 0.152: R13.2 78.04,28.27 77.57,27.79 76.62,27.79 arc90 74.56,25.73 74.44,25.61 IC4.4
DDC_SCL
  Top 0.203: SCL.1 74.87,32.87 75.34,33.35 IC2.1 75.34,34.93 73.75,36.52 73.75,38.43 75.34,40.01 | 75.34,40.01 R4.2 | HDMI.15 80.07,40.21 79.95,40.33 75.66,40.33 75.34,40.01
DDC_SDA
  Top 0.152: IC2.3
  Top 0.203: IC2.3 77.25,34.93 76.45,35.73 76.45,39.06 76.85,39.46 77.25,39.46 R3.2 77.55,39.71 HDMI.16 | SDA.1 IC2.3
DE  (via drill 0.3)
  Top 0: v44.23,40.65 44.11,40.76 44.11,40.81
  Top 0.2: 44.11,40.81 44.01,40.91 26.51,40.91 25.91,40.31 25.91,39.71 26.18,39.44 U1.30
  Top 0.203: IC1.46 68.07,30.52 v67.88,30.33
  Bottom 0.2: 56.93,33.19 59.79,30.33
  Bottom 0.203: v44.23,40.65 54.07,40.65 56.93,37.79 56.93,33.19 | 59.79,30.33 v67.88,30.33
G0
  Top 0.15: 52.64,36.2 IC1.20
  Top 0.152: 48.2,31.76 48.2,31.73 48.19,31.73 | 34.68,29.93 U1.8
  Top 0.2: 48.2,31.76 52.64,36.2 | 48.19,31.73 47.41,30.95 37.1,30.95 36.08,29.93 34.68,29.93
  Top 0.203: IC1.20
G2
  Top 0.152: 34.69,27.95 U1.4
  Top 0.2: IC1.22 52.35,35.2 45.1,27.95 34.69,27.95
G3  (via drill 0.5 pad 0.25)
  Top 0.152: U1.6 | v43.27,28.96 43.26,28.95
  Top 0.2: IC1.23 53.24,34.7 v47.42,28.88 | 43.26,28.95 U1.6
  Bottom 0.152: v47.42,28.88 47.35,28.96
  Bottom 0.2: 47.35,28.96 v43.27,28.96
G4  (via drill 0.5 pad 0.25)
  Top 0.152: 34.68,29.44 U1.7
  Top 0.2: IC1.24 53.62,34.2 v48.96,29.54 | v43.27,30.08 37.54,30.08 36.9,29.44 34.68,29.44
  Bottom 0.2: v48.96,29.54 43.81,29.54 v43.27,30.08
G5  (via drill 0.5 pad 0.25)
  Top 0.15: 34.7,31.41 U1.11
  Top 0.2: IC1.25 56.07,31.97 v55.21,31.11 | v45.41,31.61 36.61,31.61 36.41,31.41 34.7,31.41
  Bottom 0.15: v55.21,31.11 55.01,30.91
  Bottom 0.2: 55.01,30.91 46.11,30.91 v45.41,31.61
G6  (via drill 0.5 pad 0.25)
  Top 0.15: 53.71,31.61 v53.61,31.71 | 34.71,31.91 U1.12
  Top 0.2: IC1.26 58.07,30.53 57.94,30.37 54.45,30.37 53.71,31.11 53.71,31.61 | v47.51,32.31 36.61,32.31 36.21,31.91 34.71,31.91
  Top 0.203: IC1.26 58.07,31.32 58.04,31.28
  Bottom 0.2: v53.61,31.71 48.41,31.71 47.81,32.31 v47.51,32.31
G7  (via drill 0.5 pad 0.25, 0.5 pad 0.61)
  Top 0.15: v36.11,32.71 35.89,32.93 U1.14
  Top 0.2: IC1.27 58.51,31.64 58.51,30.31 58.21,30.01 54.01,30.01 52.91,31.11 v52.91,32.61
  Bottom 0.15: v52.91,32.61 52.51,33.01 36.41,33.01 v36.11,32.71
GND  (via drill 0.3)  (268 unrouted)
  Top 0.152: USB.GND 96.21,7.71 R17.1
  Top 0.254: U1.25 36.25,38.45 C26.1
  Top 0.406: C21.1 51.47,5.25 50.81,5.91 IC5.1 | C19.1 57.75,7.24 58.51,8.01 60.91,8.01 61.21,7.71 GND.1
  Top 0.61: C9.1 41.69,13.37 C7.1 C8.1
  Top 0.813: v60.26,39.7 v67.88,39.7 | v64.07,43.51 v64.07,35.89
  other vias: 64.07,39.7 62.8,39.7 65.34,39.7 66.61,39.7 67.88,40.97 66.61,40.97 65.34,40.97 64.07,40.97 62.8,40.97 61.53,40.97 60.26,40.97 61.53,39.7 60.26,42.24 60.26,43.51 61.53,43.51 62.8,43.51 58.99,43.51 58.99,42.24 58.99,40.97 58.99,39.7 69.15,39.7 69.15,40.97 67.88,42.24 69.15,42.24 65.34,42.24 66.61,42.24 64.07,42.24 62.8,42.24 61.53,42.24 60.26,44.78 61.53,44.78 62.8,44.78 64.07,44.78 58.99,44.78 65.34,43.51 66.61,43.51 67.88,43.51 69.15,43.51 65.34,44.78 66.61,44.78 67.88,44.78 69.15,44.78 65.34,35.89 66.61,35.89 67.88,35.89 69.15,35.89 60.26,37.16 60.26,38.43 61.53,38.43 62.8,38.43 64.07,38.43 58.99,38.43 58.99,37.16 67.88,37.16 69.15,37.16 65.34,37.16 66.61,37.16 64.07,37.16 62.8,37.16 61.53,37.16 65.34,38.43 66.61,38.43 67.88,38.43 69.15,38.43 60.26,34.62 60.26,35.89 61.53,35.89 62.8,35.89 58.99,35.89 58.99,34.62 67.88,34.62 69.15,34.62 65.34,34.62 66.61,34.62 64.07,34.62 62.8,34.62 61.53,34.62 57.72,33.66 40.89,14.3 29.39,25.33 83.44,39.06 66.61,49.38 64.07,49.38 62.01,49.38 73.91,48.74 71.85,48.74 83.44,40.97 79.95,41.92 60.1,51.44 60.1,53.51 85.34,40.97 87.25,40.97 89.31,41.12 78.2,41.92 76.45,41.92 74.39,42.08 74.07,43.98 74.07,46.05 89.31,53.51 82.67,27.61 83.6,28.74 71.37,23.66 92.1,26.81 75.98,26.68 74.55,27.47 75.98,28.42 82.01,26.36 82.01,28.9 78.2,23.66 93.11,13.66 88.31,11.3 65.34,24.14 84.58,26.66 37.28,20.58 30.53,20.57 54.16,21.84 74.07,34.46 64.55,19.69 89.33,31.92 22.78,20.62 27.32,20.6 88.2,52.24 86.61,52.24 62.01,51.44 64.07,51.44 60.1,49.38 33.81,20.61 85.34,44.14 88.2,42.71 85.34,42.64 85.34,48.11 85.34,46.2 78.2,18.11 70.9,30.96 85.99,31.19 40.89,16.04 40.89,17.79 49.31,14.14 55.02,46.52 58.28,50.45 49.31,12.87 27.06,44.72 56.13,46.52 79.95,39.06 56.93,23.66 46.13,10.49 49.31,7.31 56.93,7.15 71.22,17.31 82.49,11.12 85.98,11.12 56.93,19.22 70.9,28.74 77.88,29.22 77.88,26.04 80.11,28.74 80.11,26.52 87.11,12.96 76.3,33.03 62.64,9.06 45.81,42 57.67,9.68 66.29,14.61 94.98,26.66 89.38,26.66 35.38,42.16 51.18,30.06 22.58,32.33 24.58,29.23 54.18,22.83
  pour Bottom (rank 2): 0.38,0.01 102.91,0.11 102.91,54.81 0.18,54.61
  pour Top (rank 2): 0.28,0.01 102.81,0.11 102.91,54.81 0.18,54.61
GPIO
  Top 0.203: IC4.25 71.94,17.07 72.8,16.2 74.55,16.2 76.14,14.61 77.09,14.61 77.13,14.57 T8.6
HDMI_5V
  Top 0.254: 81.69,31 C23.2 | 79.68,31 HPWR.1 | 80.74,31.16 80.74,31
  Top 0.305: 80.74,31.16 80.74,36.68 81.37,37.32 82.65,37.32 83.12,37.79 83.12,38.27 82.68,38.71 HDMI.18 | 81.69,31 80.74,31 79.68,31
HDMI_DECT
  Top 0.203: HDMI.19 79.7,38.21 R2.1
HSYNC  (via drill 0.3)
  Top 0.152: U1.27 34.73,39.38
  Top 0.2: 44.17,39.44 U1.27
  Top 0.203: IC1.48 69.07,30.73 v69.47,30.33
  Top 0.254: 44.17,39.44 v44.23,39.38
  Bottom 0.2: 55.97,32.55 59.47,29.06
  Bottom 0.203: v44.23,39.38 53.75,39.38 55.97,37.16 55.97,32.55 | 59.47,29.06 68.99,29.06 69.47,29.54 v69.47,30.33
HWB
  Top 0.203: IC4.33 75.94,18.15 76.61,17.47 79.29,17.47 R15.1
LED1  (via drill 0.3, 0.5 pad 0.25)  (2 unrouted)
  Top 0.2: 86.71,28.71 86.73,28.73 | v81.69,15.73 82.68,16.71 87.31,16.71 v88.01,17.41 | R18.1 87.41,27.82 v87.41,26.41
  Top 0.203: IC4.31 74.94,17.72 76.45,16.2 80.26,16.2 80.74,15.73 v81.69,15.73
  Bottom 0.2: v87.41,26.41 88.01,25.81 v88.01,17.41
  other vias: 58.19,21.93
LED2  (via drill 0.3, 0.5 pad 0.25)  (1 unrouted)
  Top 0.2: v81.06,16.52 81.75,17.21 86.71,17.21 86.91,17.41 v86.91,17.71 | v86.71,29.71 87.52,30.52 R19.1
  Top 0.203: IC4.32 75.44,17.85 76.61,16.68 80.9,16.68 v81.06,16.52
  Bottom 0.2: v86.91,17.71 86.71,17.91 v86.71,29.71
  other vias: 73.89,39.92
LED+
  Top 0.203: LED+.1
  Top 0.254: IC3.5 43.75,17.15 43.43,16.84 39.78,16.84 | C9.2
  Top 0.406: 43.57,10.17 D6.C
  Top 0.61: LED+.1 39.78,16.84 39.78,11.28 40.89,10.17 C9.2 | C9.2 43.57,10.17
LED-
  Top 0.406: 46.93,18.17 IC3.3 47.24,18.1 47.55,18.41 LED-.1 47.55,19.52 47.58,19.56 RS1.2 RS2.2 RS3.2 RS4.2 RS5.2
LEDC
  Top 0.406: 46.45,19.85 LED-.2
LIGHT  (1 unrouted)
  Top 0.2: R16.2 81.65,21.44 80.81,20.61 79.91,20.61 79.61,20.91 79.61,21.27 C16.2 79.18,21.44 78.41,22.21 76.89,22.21 IC4.40
  Bottom 0.203: 76.61,20.01 76.61,18.42 74.23,16.04 73.28,16.04 72.64,15.41 72.64,11.6 69.43,8.39 69.43,8.23
  Bottom 0.406: 69.43,8.23 69.43,7.49 RPI.11
LV_GPIO  (via drill 0.3)
  Top 0.203: 73.91,8.1 73.12,8.9 67.09,8.9 65.18,10.8 58.99,10.8 57.72,12.07 TP_INT.2 | R24.1 76.61,12.53 | 76.61,12.53 77.06,12.53 T8.1 | v76.61,11.6 76.61,12.53
  Top 0.406: RPI.7 73.91,8.1
  Bottom 0.203: 74.55,8.26 76.61,10.33 v76.61,11.6
  Bottom 0.406: 74.55,8.26 74.55,7.49 RPI.7
LV_PWM2  (via drill 0.3)  (1 unrouted)
  Top 0.203: R25.1 78.71,14.48 T8.4 78.63,14.82 78.2,15.25 76.14,15.25 74.71,16.68 73.28,16.68 72.8,17.15 v72.8,17.31
  Bottom 0.203: v72.8,17.31 72.8,17.63 71.22,19.22 68.52,19.22 65.02,15.73
LV_RXD  (via drill 0.3)
  Top 0.203: R22.1 71.98,12.53 T7.1 72.05,12.19 72.8,11.44 75.34,11.44 v75.5,11.6
  Bottom 0.203: 73.91,5.56 73.28,6.2 73.28,8.42 75.5,10.65 v75.5,11.6
  Bottom 0.406: RPI.8 73.91,5.56
LV_SCL
  Top 0.203: 76.44,8.12 75.03,9.53 67.4,9.53 66.45,10.49 66.45,11.44 | 66.45,11.44 61.21,11.44 60.58,12.07 TP_SCL.2 | T6.1 67.37,12.53 R20.1 66.45,11.44
  Top 0.406: 76.44,8.12 76.44,8.11 RPI.5
LV_SDA  (via drill 0.3)
  Top 0.203: v67.72,10.33 67.88,10.17 76.93,10.17 78.98,8.12 | R21.1 69.15,14.48 | 69.15,14.48 69.02,14.48 | 69.02,14.48 T6.4 | TP_SDA.2 v59.15,11.6 | 69.02,14.48 68.99,14.46 | v69.15,15.25 69.15,14.48
  Top 0.406: 78.98,8.12 78.98,8.11 RPI.3
  Bottom 0.203: v69.15,15.25 69.15,11.76 v67.72,10.33 67.56,10.17 60.58,10.17 v59.15,11.6
LV_TXD  (via drill 0.3)
  Top 0.203: T7.4 73.63,14.48 R23.1 75.32,14.48 v75.34,14.46
  Bottom 0.203: v75.34,14.46 75.34,12.39 74.55,11.6 73.91,11.6 70.74,8.42 70.74,6.2 71.37,5.56
  Bottom 0.406: RPI.10 71.37,5.56
LX
  Top 0.203: 47.56,13.75 L1.2 | 48.35,10.51 D6.A
  Top 0.406: IC3.1 46.86,15.64 | 47.56,14.93 47.56,13.75
  Top 0.61: 46.86,15.64 47.56,14.93 | L1.2 47.65,12.3 48.35,11.6 48.35,10.51
MISO
  Top 0.152: IC4.11 70.51,25.16 68.99,26.68 65.34,26.68 64.71,26.04 64.71,21.28 63.44,20.01
  Top 0.406: 63.44,20.01 ISP.MISO
MOSI
  Top 0.152: 60.74,21.92 61.37,21.28 63.59,21.28 64.39,22.07 64.39,26.2 65.18,27 69.15,27 70.26,25.88 71.22,25.88 71.44,25.66 IC4.10
  Top 0.406: ISP.MOSI 60.74,21.92
N$1
  Top 0.406: RS3.1 51.05,18.11 50.42,17.47 J20_2.1
N$3
  Top 0.203: IC1.44 67.07,29.7 R10.1
N$4
  Top 0.406: RS4.1 52.16,17.95 51.85,17.63 J30_1.1
N$5
  Top 0.406: RS2.1 49.94,18.26 48.99,17.31 J20_1.1
N$6
  Top 0.152: SW1.1 SW1.2
  Top 0.2: SW1.1 85.51,2.96 85.51,9.01 84.81,9.71 81.31,9.71 80.76,10.26 R26.2
N$7
  Top 0.406: RS5.1 J30_2.1
N$10  (via drill 0.3 pad 0.25)
  Top 1.676: 9.61,1.71 v82.21,1.71
  Top 1.778: J1.3 9.01,25.31 J1.2 9.01,12.91 6.11,10.01 6.11,5.21 9.61,1.71
  Bottom 1.27: v82.21,1.71 85.01,4.51 86.91,4.51 87.67,5.27 JP1.1
N$11  (1 unrouted)
N$17
  Top 0.2: R18.2 LED1.A
N$18
  Top 0.2: R19.2 LED2.A
OCKINV
  Top 0.2: 53.04,49.03 53.06,49.01 57.61,49.01 58,48.62 58.07,48.62
  Top 0.203: IC1.100 58.07,48.62 | 53.04,49.03 51.77,49.03 51.47,48.73 OCK.1 R5.2
PDO
  Top 0.152: 47.08,39.38 47.06,39.38
  Top 0.203: 47.08,39.38 49.63,39.38 52.14,41.9 R9.1 54.25,41.9 54.45,41.7 IC1.9
PIXS
  Top 0.2: 54.81,44.2 53.84,45.17 53.79,45.17
  Top 0.203: IC1.4 54.81,44.2 | R6.2 PIXS.1 51.47,45.52 51.77,45.22 52.72,45.22 53.79,45.17
PWM1  (via drill 0.3)
  Top 0.203: IC3.4 43.91,18.1 | 43.91,18.1 43.59,17.79 RE1.2 | IC3.4 43.91,18.1 43.91,18.11 | RE2.1 43.46,18.72 43.91,18.26 43.91,18.11 | 43.91,18.11 43.91,18.1 | IC4.29 73.94,17.49 v73.75,17.31 | IC3.4 v45.49,18.1 v45.5,18.11
  Bottom 0.2: 68.83,5.56 68.2,6.2 68.2,8.26 | 45.51,18.09 v45.5,18.11
  Bottom 0.203: v45.5,18.11 46.13,18.11 49.15,15.09 65.18,15.09 68.83,18.74 70.9,18.74 71.85,17.79 71.85,16.52 | 68.2,8.26 71.85,11.91 71.85,16.52 | v73.75,17.31 73.75,17.15 73.12,16.52 71.85,16.52
  Bottom 0.406: RPI.12 68.83,5.56
PWM2
  Top 0.203: IC4.30 74.44,17.58 76.29,15.73 79.79,15.73 80.58,14.93 80.58,13.03 79.95,12.39 78.84,12.39 T8.3
PWM3  (via drill 0.5 pad 0.25)  (1 unrouted)
  other vias: 62.71,6.21
R0
  Top 0.2: U1.50 30.29,29.43 33.81,25.91 50.91,25.91 54.61,29.61 58.51,29.61 59.31,30.41 59.61,30.41 60.01,30.81 60.01,31.64 IC1.30 60.11,31.66
R1  (via drill 0.5 pad 0.25, 0.5 pad 0.61)
  Top 0.2: IC1.31 60.57,30.77 58.61,28.81 v56.81,28.81 | U1.2 34.71,26.91 35.91,26.91 36.41,27.41 v47.11,27.41
  Bottom 0.2: v47.11,27.41 51.51,27.41 52.91,28.81 v56.81,28.81
R2
  Top 0.152: U1.51 27.14,28.91
  Top 0.2: 27.14,28.91 30.21,28.91 33.81,25.31 51.81,25.31 54.41,27.91 58.31,27.91 61.01,30.61 61.01,31.64 IC1.32
R3
  Top 0.2: U1.52 29.98,28.44 33.81,24.61 51.71,24.61 54.61,27.51 58.51,27.51 61.61,30.61 61.61,31.66 IC1.33
R4
  Top 0.2: U1.54 30.27,27.45 33.81,23.91 51.71,23.91 54.81,27.01 58.71,27.01 62.11,30.41 62.11,31.66 IC1.34
R5
  Top 0.152: IC1.35
  Top 0.2: U1.55 30.08,26.94 33.81,23.21 51.71,23.21 55.01,26.51 58.81,26.51 62.61,30.31 62.61,31.66 IC1.35
R6  (2 unrouted)
  Top 0.2: IC1.36 63.07,30.07 59.01,26.01 55.11,26.01 51.71,22.61 33.61,22.61 29.81,26.41 27.81,26.41
  Top 0.254: 27.64,26.43 U1.56
R7  (via drill 0.5 pad 0.61)
  Top 0.2: IC1.37 63.57,28.67 61.41,26.51 61.41,24.21 61.01,23.81 58.51,23.81 56.81,25.51 55.31,25.51 51.81,22.01 32.71,22.01 v31.31,23.41 | v32.81,27.91 33.27,27.45 U1.3
  Bottom 0.2: v31.31,23.41 31.31,26.41 v32.81,27.91
RST  (via drill 0.3)
  Top 0.203: IC4.13 69.53,23.76 68.52,24.77 v68.52,25.25 68.2,25.57 R12.1
  Bottom 0.203: v68.52,25.25 68.36,25.09 63.44,25.09
  Bottom 0.406: ISP.RST 63.44,25.09
RX0+
  Top 0.2: U1.47 24.83,30.93 arc90 22.81,28.91 22.81,27.51 arc-90 20.91,25.61 18.86,25.61 arc90 SV1.8
RX0-
  Top 0.152: 20.1,24.31 arc90 SV1.7
  Top 0.2: SV1.7 20.1,24.31 22.31,24.31 arc90 23.31,25.31 23.31,28.81 arc-90 24.95,30.44 U1.48
RX1+
  Top 0.2: U1.45 27.07,31.91 24.41,31.91 arc90 21.81,29.31 21.81,29.01 arc-90 20.91,28.11 18.82,28.11 arc90 SV1.10
RX1-
  Top 0.2: 20.07,26.86 SV1.9 arc90 22.31,29.06 22.31,29.21 arc-90 24.51,31.41 27.08,31.41 U1.46
RX2+
  Top 0.2: U1.41 21.85,33.95 arc90 21.51,33.61 arc-90 21.11,33.21 16.81,33.21 arc90 16.11,32.51 16.11,30.77 arc90 SV1.12
RX2-
  Top 0.152: SV1.11 20.26,29.36 | 27.07,33.41 arc90 U1.42
  Top 0.2: 20.26,29.36 arc90 21.51,30.61 21.51,32.21 arc-90 22.71,33.41 27.07,33.41
RX3+
  Top 0.2: U1.37 25.59,35.93 arc-90 23.51,38.01 23.51,38.41 arc90 20.81,41.11 19.12,41.11 arc90 SV1.20
RX3-  (1 unrouted)
  Top 0.2: 20.1,39.52 SV1.19 21.8,39.52 arc-90 23.11,38.21 23.11,37.91 arc90 25.61,35.41 27.51,35.41
RXD
  Top 0.203: IC4.20 69.4,20.26 68.68,19.54 68.68,16.84 70.1,15.41 71.22,15.41 72.05,14.57 T7.6
SCDT
  Top 0.203: IC1.8 54.9,42.2 54.21,42.9 R9.2
SCK
  Top 0.152: 63.44,22.55 64.07,23.19 64.07,26.36 65.02,27.31 69.31,27.31 70.26,26.36 71.37,26.36 71.94,25.8 IC4.9
  Top 0.406: ISP.SCK 63.44,22.55
SCL  (via drill 0.3)
  Top 0.203: v72.48,23.66 72.48,22.39 71.35,21.26 IC4.18 69.13,21.26 67.72,19.85 67.72,16.52 67.45,16.24 T6.6 | SCL.2 74.87,30.65 74.71,30.49 73.6,30.49 v73.12,30.01
  Bottom 0.203: v72.48,23.66 72.48,29.38 v73.12,30.01
SDA  (via drill 0.3)
  Top 0.203: v68.2,15.88 68.2,19.69 69.26,20.76 IC4.19 71.64,20.76 73.6,22.71 v73.6,23.66 | SDA.2 77.25,30.49 76.29,29.54 v75.03,29.54 | T6.3 68.95,12.19 68.36,11.6 v67.72,11.6
  Bottom 0.203: v73.6,23.66 73.6,28.11 v75.03,29.54 | v67.72,11.6 68.2,12.07 v68.2,15.88
SENSE  (1 unrouted)
  Top 0.254: IC4.26 72.41,18.38 72.41,19.11
SHLD1  (3 unrouted)
SHLD3
  Top 0.406: R1.2 86.11,34.61 HDMI.SHLD2
  Bottom 0.406: 86.3,35.25 82.51,35.25 HDMI.SHLD1 | 86.3,35.25 87.41,35.25 HDMI.SHLD2 | 86.3,35.25 86.3,49.7 | 86.3,49.7 87.41,49.7 HDMI.SHLD3 | 86.3,49.7 HDMI.SHLD4
SOURCE
  Top 0.813: L3.2 84.25,15.91 87.21,15.91 90.11,13.01 90.11,8.61 JP1.2
ST
  Top 0.2: ST.1 51.51,47.08 51.51,46.81 51.81,46.51 53.51,46.51 54.41,45.61 54.41,45.21 54.92,44.7 IC1.3
  Top 0.203: R7.2 ST.1
STAG  (1 unrouted)
  Top 0.2: 51.47,44.25 52.11,43.61 54.11,43.61 55.02,42.7 55.2,42.7
  Top 0.203: IC1.7 55.2,42.7 | STAG.2 51.47,44.25
SW1  (via drill 0.3)
  Top 0.203: IC4.22 69.83,19.26 69.79,19.22 69.79,17.79 v70.26,17.31 | R26.1 70.9,10.8 v70.1,11.6
  Bottom 0.2: 66.93,8.26 70.1,11.44
  Bottom 0.203: v70.26,17.31 70.26,11.76 v70.1,11.6 70.1,11.44 | 66.93,7.49 RPI.13
  Bottom 0.406: 66.93,8.26 66.93,7.49
TXD  (via drill 0.3)
  Top 0.203: IC4.21 69.53,19.76 69.15,19.38 69.15,17.15 70.26,16.04 72.17,16.04 72.8,15.41 v73.75,15.41 | T7.3 73.75,12.39 v74.39,12.39
  Bottom 0.203: v73.75,15.41 73.75,13.03 v74.39,12.39
UCAP
  Top 0.203: IC4.6 C10.2
USBD_N  (4 unrouted)
  Top 0.152: R14.1 79.31,27 79.79,27.48 80.58,27.48 80.58,27.47 D1.2 | D1.2 81.05,27 82.65,27 arc-90 82.96,26.69 82.96,25.88 arc90 83.79,25.06 arc-90 83.81,25.08 84.04,24.98 93.71,24.98 arc-90 94.29,24.41 94.29,7.01 | D1.2 | USB.D- arc90 94.29,5.82 94.29,7.21
USBD_P  (4 unrouted)
  Top 0.152: R13.1 79.31,28.27 79.79,27.78 80.58,27.78 D1.1 | D1.1 81.06,28.26 82.49,28.26 arc-90 83.43,27.31 83.43,26.52 arc90 84.42,25.53 84.64,25.63 93.71,25.63 arc-90 94.94,24.41 94.94,7.01 | D1.1 | USB.D+ arc90 94.94,5.82 94.94,7.21
USBV  (via drill 0.3 pad 0.25)  (3 unrouted)
  Top 0.406: USB.VBUS 93.61,7.01
  Top 0.61: 93.61,7.01 93.51,7.11
  Top 0.813: 93.51,7.11 92.75,7.87 JP1.3
  other vias: 98.81,10.71 98.91,8.01
VCCIO  (via drill 0.3)
  Top 0.203: T6.2 68.2,13.5 T6.5 | T7.2 72.8,13.5 T7.5 | 79.61,13.5 R25.2 | R24.2 76.14,13.5 | R23.2 74.55,13.5 | T8.5 77.88,13.5 T8.2 v77.88,11.6 | R21.2 69.95,13.5 | R22.2 71.06,13.5 | R20.2 66.45,13.5
  Top 0.254: 79.61,13.5 77.88,13.5 76.14,13.5 74.55,13.5 72.8,13.5 71.06,13.5 69.95,13.5 68.2,13.5 66.45,13.5 65.98,13.5 65.5,13.03 65.5,12.55 65.02,12.07 63.91,12.07 63.44,12.55 VCCIO.2
  Bottom 0.203: 81.53,8.1 78.04,11.6 v77.88,11.6
  Bottom 0.406: RPI.1 81.53,8.1
VSYNC  (via drill 0.3)
  Top 0.152: U1.28 34.75,40.01
  Top 0.2: 34.75,40.01 v47.4,40.01
  Top 0.203: 47.3,39.91 v47.4,40.01 | IC1.47 68.57,29.96 v68.68,29.85
  Bottom 0.203: v47.4,40.01 53.91,40.01 56.45,37.47 56.45,32.87 59.63,29.7 68.52,29.7 v68.68,29.85
X+  (via drill 0.3, 0.5 pad 0.25)  (1 unrouted)
  Top 0.2: SV4.7 91.61,16.97 91.61,21.51 91.11,22.01 87.51,22.01 87.01,22.51 v81.61,22.51
  Top 0.203: IC4.39 76.14,21.76 75.66,22.23 v75.5,22.23 | v58.36,18.26 58.2,18.11 58.2,16.99 59.15,16.04 TP_SDA.1
  Bottom 0.2: v81.61,22.51 81.34,22.23 v75.5,22.23 75.03,22.23 74.07,21.28
  Bottom 0.203: v58.36,18.26 64.39,18.26 67.4,21.28 74.07,21.28
  other vias: 50.34,42.2
X-  (via drill 0.3, 0.5 pad 0.25)  (1 unrouted)
  Top 0.2: SV4.5 89.77,18.81 83.61,18.81 v82.81,19.61
  Top 0.203: IC4.37 75.61,20.76 v75.5,20.65
  Bottom 0.2: v82.81,19.61 81.77,20.65 v75.5,20.65
XTAL1
  Top 0.203: IC4.17 68.68,21.76 67.32,20.4 Q1.2
XTAL2
  Top 0.203: IC4.16 68.18,22.26 67.63,22.8 Q1.1
Y+  (via drill 0.3)
  Top 0.2: SV4.3 89.82,20.26 IC4.36
  Top 0.203: IC4.36 76.07,20.26 75.66,19.85 v75.18,19.85 | TP_INT.1 v57.72,16.36
  Bottom 0.2: 68.36,19.85 v75.18,19.85
  Bottom 0.203: v57.72,16.36 64.86,16.36 68.36,19.85
Y-  (via drill 0.3, 0.5 pad 0.25)
  Top 0.2: SV4.1 90.15,23.51 v83.01,23.51
  Top 0.203: IC4.38 75.68,21.26 75.5,21.44 v75.18,21.44 | v58.99,17.63 58.99,16.99 60.58,15.41 TP_SCL.1
  Bottom 0.2: v83.01,23.51 82.51,23.01 82.51,22.01 81.94,21.44 v75.18,21.44 74.55,20.81 74.39,20.81
  Bottom 0.203: v58.99,17.63 64.55,17.63 67.72,20.81 74.39,20.81

## Text on the board
Top: TOP
Bottom: BOT
tPlace: o | 40 | 40 | EDID | (LED) | (LED) | GND | RST | o | 1 | 1 | 5V | 5V | 5V | 2 | 1 | 20 20 30 30 | LED Boost Converter | 3V3 | 5V | 1 | 16
Reference: Silkscreen: 21 tPlace